# EasyEDA Pro project v7_h no callsign.eprj

# Schematic Schematic1
Board Name: Board1; Create Date: 2025-07-11; Page Name: P1; Project Name: v7_h; Schematic Name: Schematic1; Update Date: 2025-07-15; Company: KC3LBR; Drawed: EasyEDA Pro; Page Size: A3; Part Number: JLCPCB-001; Reviewed: EasyEDA Pro; Version: 2023.09.11
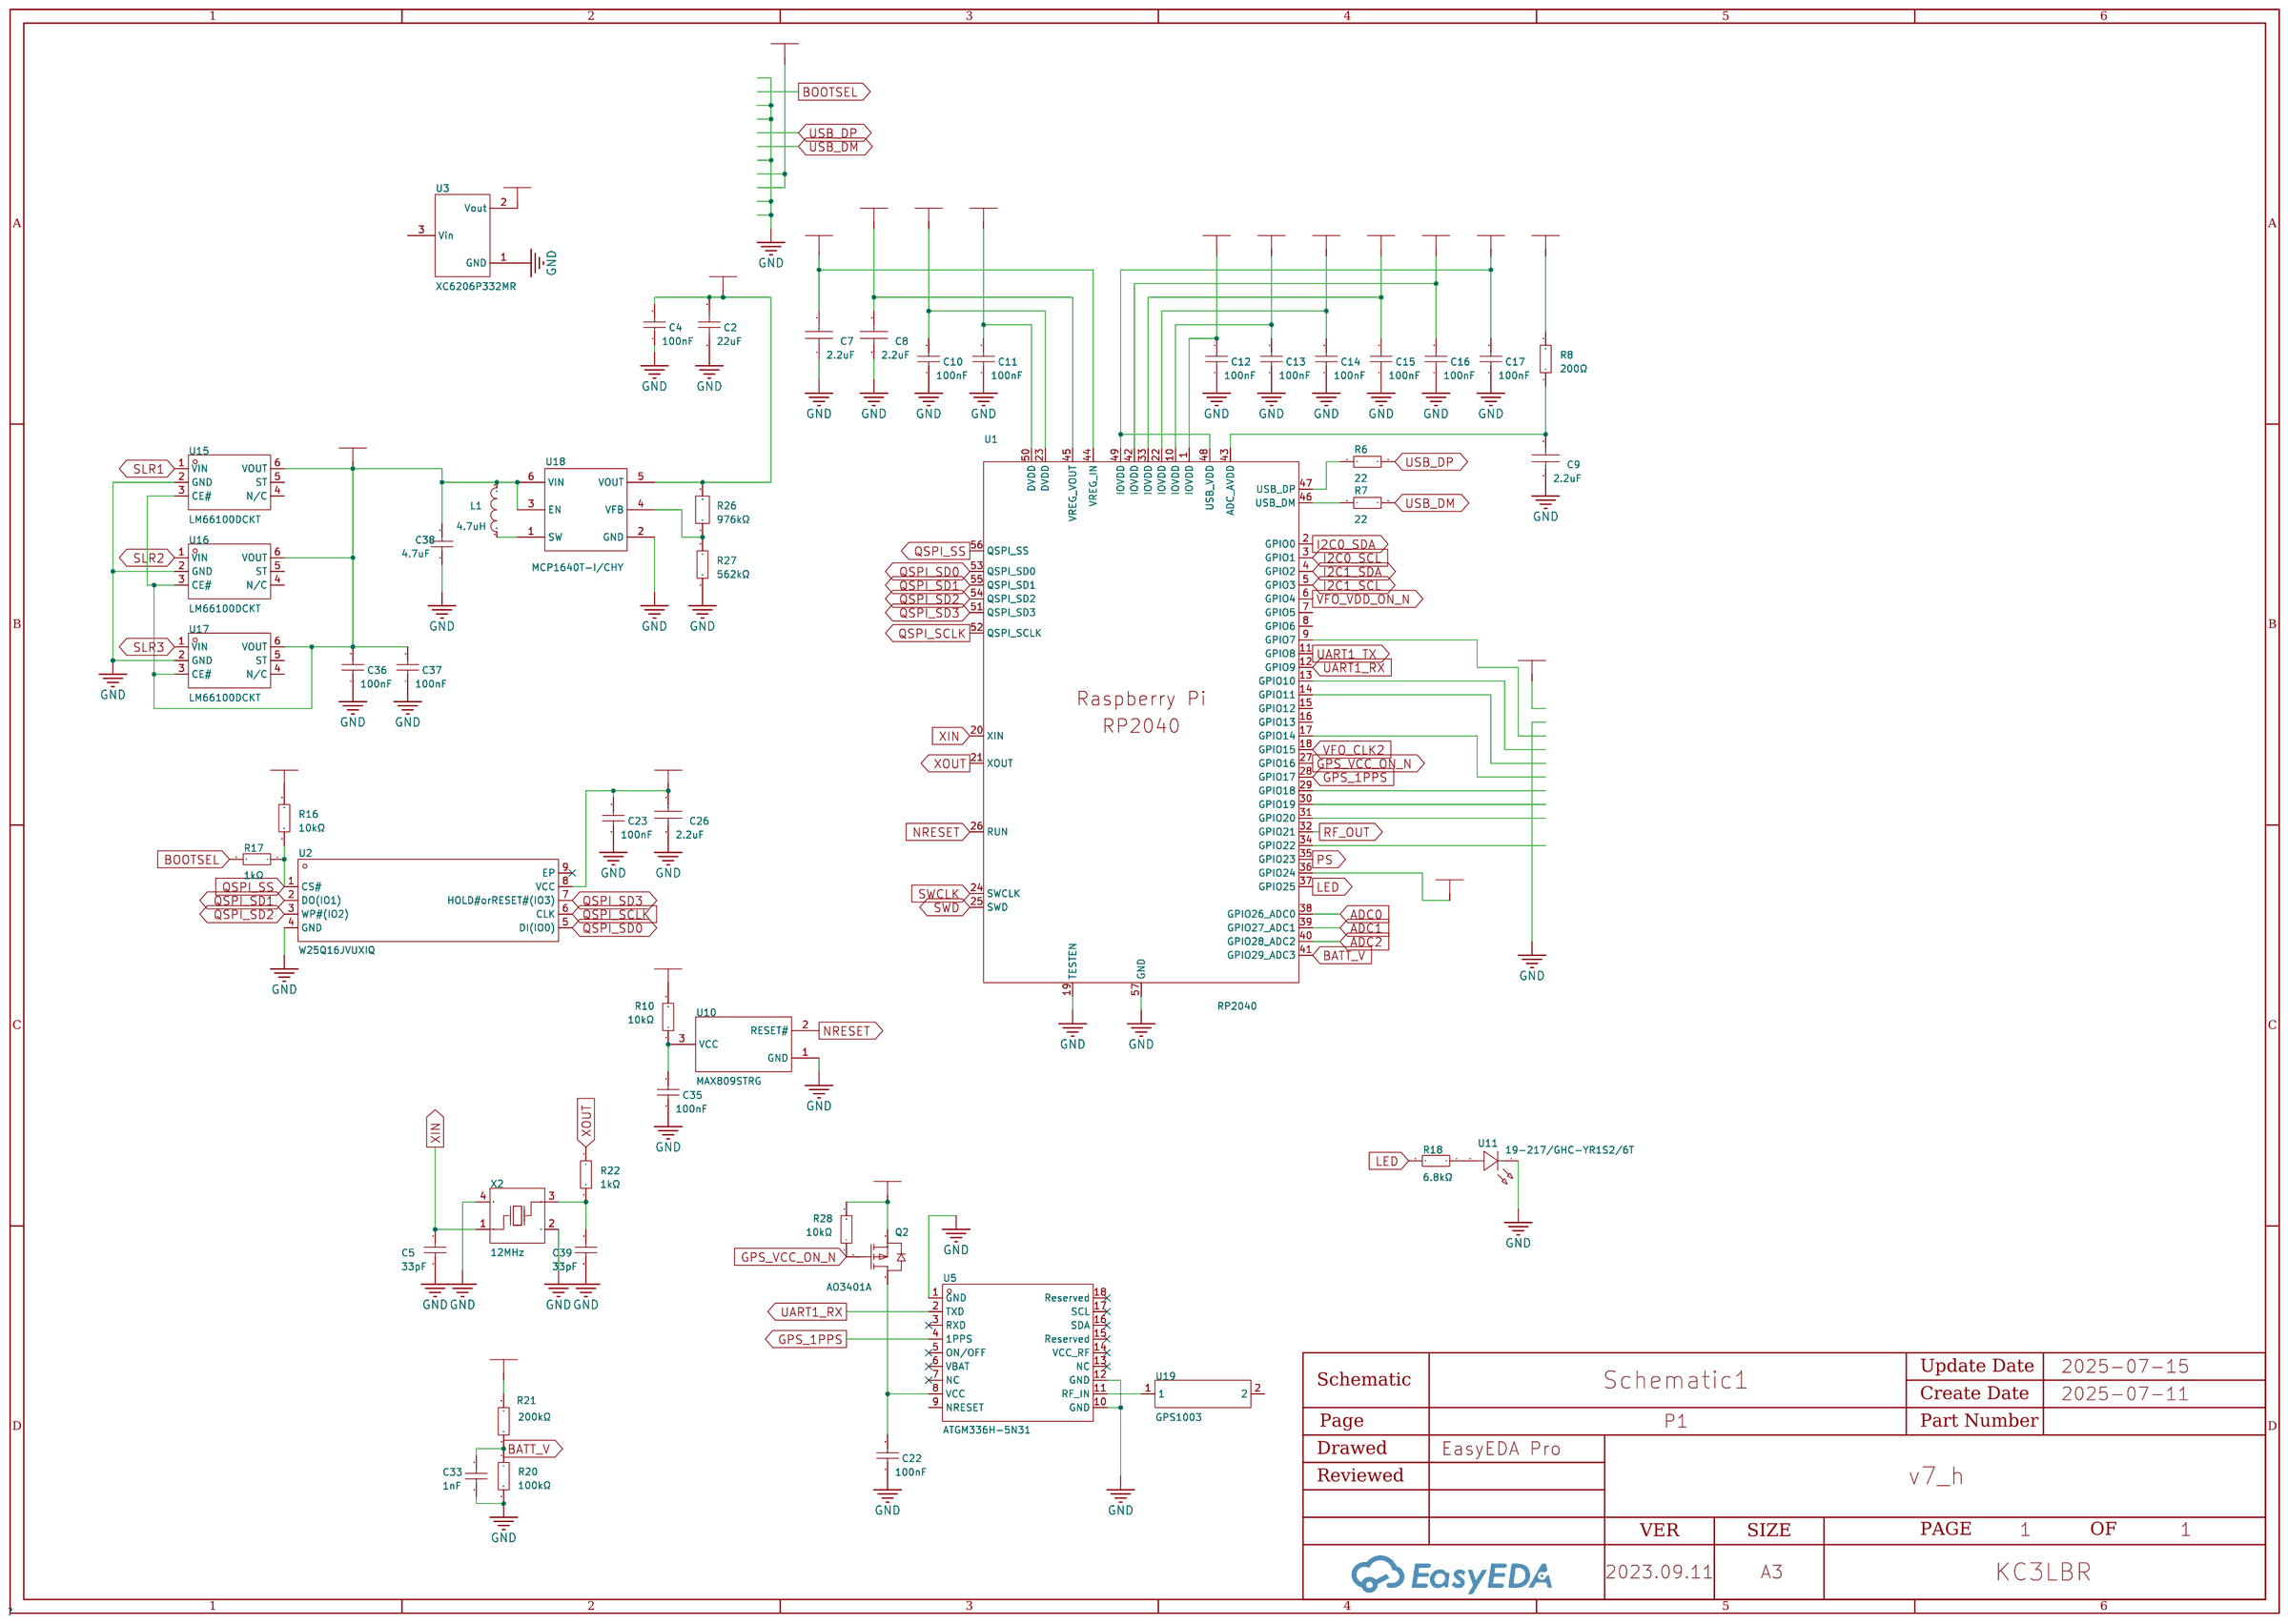
[diagram p0: schematic sheet]

## Parts
C2  22uF  [C0603]
C4  100nF  [C0402]
C5  33pF  [C0402]
C7  2.2uF  [C0402]
C8  2.2uF  [C0402]
C9  2.2uF  [C0402]
C10  100nF  [C0402]
C11  100nF  [C0402]
C12  100nF  [C0402]
C13  100nF  [C0402]
C14  100nF  [C0402]
C15  100nF  [C0402]
C16  100nF  [C0402]
C17  100nF  [C0402]
C22  100nF  [C0402]
C23  100nF  [C0402]
C26  2.2uF  [C0402]
C33  1nF  [C0402]
C35  100nF  [C0402_NEW]
C36  100nF  [C0402_NEW]
C37  100nF  [C0402_NEW]
C38  4.7uF  [C0603]
C39  33pF  [C0402]
L1  4.7uH  [IND-SMD_L2.5-W1.8]
Q2  AO3401A  [SOT-23_L2.9-W1.3-P1.90-LS2.4-BR]
R6  22  [R0402]
R7  22  [R0402]
R8  200Ω  [R0402]
R10  10kΩ  [R0402]
R16  10kΩ  [R0402]
R17  1kΩ  [R0402]
R18  6.8kΩ  [R0402]
R20  100kΩ  [R0402]
R21  200kΩ  [R0402]
R22  1kΩ  [R0402]
R26  976kΩ  [R0402]
R27  562kΩ  [R0402]
R28  10kΩ  [R0402]
U1  RP2040  [LQFN-56_L7.0-W7.0-P0.4-EP]
U2  W25Q16JVUXIQ  [USON-8_L3.0-W2.0-P0.50-BL-EP]
U3  XC6206P332MR  [SOT-23-3_L2.9-W1.3-P1.90-LS2.4-BR]
U5  ATGM336H-5N31  [GPSM-SMD_ATGM336H-TR]
U10  MAX809STRG  [SOT-23-3_L2.9-W1.6-P1.90-LS2.8-BR]
U11  19-217/GHC-YR1S2/6T  [LED0603-RD_GREEN]
U15  LM66100DCKT  [SC-70-6_L2.0-W1.3-P0.65-LS2.1-BL]
U16  LM66100DCKT  [SC-70-6_L2.0-W1.3-P0.65-LS2.1-BL]
U17  LM66100DCKT  [SC-70-6_L2.0-W1.3-P0.65-LS2.1-BL]
U18  MCP1640T-I/CHY  [SOT-23-6_L2.9-W1.6-P0.95-LS2.8-BR]
U19  GPS1003  [ANT-SMD_L10.0-W3.0]
X2  12MHz  [CRYSTAL-SMD_4P-L3.2-W2.5-BL]

## Library data of the parts
C2 = CL10A226MQ8NRNC: Capacitance: Tolerance:±20% Tolerance:±20% Voltage Rated: Temperature Coefficient:; LCSC Part Name: 22uF ±20% 6.3V; Supplier Part: C59461; Manufacturer: SAMSUNG(三星); Supplier Footprint: 0603; JLCPCB Part Class: Basic Part; Datasheet: https://atta.szlcsc.com/upload/public/pdf/source/20160218/1457707763339.pdf; Supplier: LCSC; Tolerance: ±20%
C4 C10-C17 C22 C23 = CL05B104KO5NNNC: Capacitance: Tolerance:±10% Tolerance:±10% Voltage Rated: Temperature Coefficient:; LCSC Part Name: 100nF ±10% 16V; Supplier Part: C1525; Manufacturer: SAMSUNG(三星); Supplier Footprint: 0402; JLCPCB Part Class: Basic Part; Datasheet: https://atta.szlcsc.com/upload/public/pdf/source/20160218/1457707763339.pdf; Supplier: LCSC; Tolerance: ±10%
C5 C39 = 0402CG330J500NT: Capacitance: Tolerance:±5% Tolerance:±5% Voltage Rated: Temperature Coefficient:; LCSC Part Name: 33pF ±5% 50V; Supplier Part: C1562; Manufacturer: FH(风华); Supplier Footprint: 0402; JLCPCB Part Class: Basic Part; Datasheet: https://atta.szlcsc.com/upload/public/pdf/source/20200305/C486355_26A10D38EF8C2A5C37091D0039909270.pdf; Supplier: LCSC; Tolerance: ±5%
C7-C9 C26 = CL05A225MQ5NSNC: Capacitance: Tolerance:±20% Tolerance:±20% Voltage Rated: Temperature Coefficient:; LCSC Part Name: 2.2uF ±20% 6.3V; Supplier Part: C12530; Manufacturer: SAMSUNG(三星); Supplier Footprint: 0402; JLCPCB Part Class: Basic Part; Datasheet: https://atta.szlcsc.com/upload/public/pdf/source/20160218/1457707763339.pdf; Supplier: LCSC; Tolerance: ±20%
C33 = 0402B102K500NT: Capacitance: Tolerance:±10% Tolerance:±10% Voltage Rated: Temperature Coefficient:; LCSC Part Name: 1nF ±10% 50V; Supplier Part: C1523; Manufacturer: FH(风华); Supplier Footprint: 0402; JLCPCB Part Class: Basic Part; Datasheet: https://atta.szlcsc.com/upload/public/pdf/source/20170923/C1523_1506149254821988331.pdf; Supplier: LCSC; Tolerance: ±10%
C35-C37 = CL05B104KO5NNNC: Capacitance: Tolerance:±10% Tolerance:±10% Voltage Rated: Temperature Coefficient:; LCSC Part Name: 100nF ±10% 16V; Supplier Part: C1525; Manufacturer: SAMSUNG(三星); Supplier Footprint: 0402; JLCPCB Part Class: Basic Part; Datasheet: https://atta.szlcsc.com/upload/public/pdf/source/20160103/1457707674891.pdf; Supplier: LCSC; Tolerance: ±10%
C38 = CL10A475KO8NNNC: Capacitance: Tolerance:±10% Tolerance:±10% Voltage Rated: Temperature Coefficient:; LCSC Part Name: 4.7uF ±10% 16V; Supplier Part: C19666; Manufacturer: SAMSUNG(三星); Supplier Footprint: 0603; JLCPCB Part Class: Basic Part; Datasheet: https://atta.szlcsc.com/upload/public/pdf/source/20160103/1457707703134.pdf; Supplier: LCSC; Tolerance: ±10%
L1 = CBC2518T4R7M: Type:- Inductance: Tolerance:±20% Tolerance:±20% Rated Current: Saturation Current (Isat):680mA DC Resistance (DCR): Ratings:-; LCSC Part Name: 4.7uH ±20% 680mA; Supplier Part: C268002; Manufacturer: TAIYO YUDEN(太诱); Supplier Footprint: SMD; JLCPCB Part Class: Extended Part; Datasheet: https://atta.szlcsc.com/upload/public/pdf/source/20180820/C268002_0E22732304EF0852B3951C6629BBBAB5.pdf; Supplier: LCSC; Tolerance: ±20%; Saturation Current (Isat): 680mA
Q2 = AO3401A_C15127: Type: Drain Source Voltage (Vdss): Continuous Drain Current (Id): Power Dissipation (Pd): Drain Source On Resistance (RDS(on)@Vgs,Id):44mΩ@10V,4.3A Gate Threshold Voltage (Vgs(th)@Id):1.3V@250uA; LCSC Part Name: P沟道 30V 4A; Supplier Part: C15127; Manufacturer: AOS; Supplier Footprint: SOT-23; JLCPCB Part Class: Basic Part; Datasheet: https://atta.szlcsc.com/upload/public/pdf/source/20160507/1462613609053.pdf; Supplier: LCSC; Drain Source On Resistance (RDS(on)@Vgs,Id): 44mΩ@10V,4.3A; Gate Threshold Voltage (Vgs(th)@Id): 1.3V@250uA
R6 R7 = 0402WGF220JTCE: LCSC Part Name: 22Ω(22R0) ±1% 编带; Supplier Part: C25092; Manufacturer: UNI-ROYAL(厚声); Supplier Footprint: 0402; JLCPCB Part Class: Basic Part; Datasheet: https://atta.szlcsc.com/upload/public/pdf/source/20170920/C25092_1505901206069982723.pdf; Supplier: LCSC
R8 = 0402WGF2000TCE: Type:Thick Film Resistors Resistance: Tolerance:±1% Tolerance:±1% Power(Watts): Temperature Coefficient:±100ppm/ Temperature Coefficient:±100ppm/ Overload Voltage (Max): Operating Temperature Range:-55~+155 Operating Temperature Range:-55~+155; LCSC Part Name: 200Ω ±1% 62.5mW; Supplier Part: C25087; Manufacturer: UNI-ROYAL(厚声); Supplier Footprint: 0402; JLCPCB Part Class: Basic Part; Datasheet: https://atta.szlcsc.com/upload/public/pdf/source/20200306/C422600_1E6D84923E4A46A82E41ADD87F860B5C.pdf; Supplier: LCSC; Type: Thick Film Resistors; Tolerance: ±1%; Temperature Coefficient: ±100ppm/; Operating Temperature Range: -55~+155
R10 R16 R28 = 0402WGF1002TCE: Type:Thick Film Resistors Resistance: Tolerance:±1% Tolerance:±1% Power(Watts): Temperature Coefficient:±100ppm/ Temperature Coefficient:±100ppm/ Overload Voltage (Max): Operating Temperature Range:-55~+155 Operating Temperature Range:-55~+155; LCSC Part Name: 10kΩ ±1% 62.5mW; Supplier Part: C25744; Manufacturer: UNI-ROYAL(厚声); Supplier Footprint: 0402; JLCPCB Part Class: Basic Part; Datasheet: https://atta.szlcsc.com/upload/public/pdf/source/20200306/C422600_1E6D84923E4A46A82E41ADD87F860B5C.pdf; Supplier: LCSC; Type: Thick Film Resistors; Tolerance: ±1%; Temperature Coefficient: ±100ppm/; Operating Temperature Range: -55~+155
R17 R22 = 0402WGF1001TCE: Type:Thick Film Resistors Resistance: Tolerance:±1% Tolerance:±1% Power(Watts): Temperature Coefficient:±100ppm/ Temperature Coefficient:±100ppm/ Overload Voltage (Max): Operating Temperature Range:-55~+155 Operating Temperature Range:-55~+155; LCSC Part Name: 1kΩ ±1% 62.5mW; Supplier Part: C11702; Manufacturer: UNI-ROYAL(厚声); Supplier Footprint: 0402; JLCPCB Part Class: Basic Part; Datasheet: https://atta.szlcsc.com/upload/public/pdf/source/20200306/C422600_1E6D84923E4A46A82E41ADD87F860B5C.pdf; Supplier: LCSC; Type: Thick Film Resistors; Tolerance: ±1%; Temperature Coefficient: ±100ppm/; Operating Temperature Range: -55~+155
R18 = 0402WGF6801TCE: Type:Thick Film Resistors Resistance: Tolerance:±1% Tolerance:±1% Power(Watts): Temperature Coefficient:±100ppm/ Temperature Coefficient:±100ppm/ Overload Voltage (Max): Operating Temperature Range:-55~+155 Operating Temperature Range:-55~+155; LCSC Part Name: 6.8kΩ ±1% 62.5mW; Supplier Part: C25917; Manufacturer: UNI-ROYAL(厚声); Supplier Footprint: 0402; JLCPCB Part Class: Basic Part; Datasheet: https://atta.szlcsc.com/upload/public/pdf/source/20200306/C422600_1E6D84923E4A46A82E41ADD87F860B5C.pdf; Supplier: LCSC; Type: Thick Film Resistors; Tolerance: ±1%; Temperature Coefficient: ±100ppm/; Operating Temperature Range: -55~+155
R20 = 0402WGF1003TCE: Type:Thick Film Resistors Resistance: Tolerance:±1% Tolerance:±1% Power(Watts): Temperature Coefficient:±100ppm/ Temperature Coefficient:±100ppm/ Overload Voltage (Max): Operating Temperature Range:-55~+155 Operating Temperature Range:-55~+155; LCSC Part Name: 100kΩ ±1% 62.5mW; Supplier Part: C25741; Manufacturer: UNI-ROYAL(厚声); Supplier Footprint: 0402; JLCPCB Part Class: Basic Part; Datasheet: https://atta.szlcsc.com/upload/public/pdf/source/20200306/C422600_1E6D84923E4A46A82E41ADD87F860B5C.pdf; Supplier: LCSC; Type: Thick Film Resistors; Tolerance: ±1%; Temperature Coefficient: ±100ppm/; Operating Temperature Range: -55~+155
R21 = 0402WGF2003TCE: Resistance: Tolerance: Power(Watts): Temperature Coefficient: Temperature Coefficient: Overload Voltage (Max): Operating Temperature Range: Operating Temperature Range:; LCSC Part Name: 200KΩ ±1%; Supplier Part: C25764; Manufacturer: UNI-ROYAL(厚声); Supplier Footprint: 0402; JLCPCB Part Class: Basic Part; Datasheet: https://atta.szlcsc.com/upload/public/pdf/source/20170920/C25764_1505901532268983339.pdf; Supplier: LCSC
R26 = RC0402FR-07976KL: Type:Thick Film Resistors Resistance: Tolerance:±1% Tolerance:±1% Power(Watts): Overload Voltage (Max): Temperature Coefficient:±100ppm/℃ Temperature Coefficient:±100ppm/℃ Operating Temperature Range:-55℃~+155℃ Operating Temperature Range:-55℃~+155℃; LCSC Part Name: 厚膜电阻 976kΩ ±1% 62.5mW; Supplier Part: C273699; Manufacturer: YAGEO(国巨); Supplier Footprint: 0402; JLCPCB Part Class: Extended Part; Datasheet: https://atta.szlcsc.com/upload/public/pdf/source/20191125/C364360_EA870FADD46A2AD4DBE56DD50D360B3E.pdf; Supplier: LCSC; Type: Thick Film Resistors; Tolerance: ±1%; Temperature Coefficient: ±100ppm/℃; Operating Temperature Range: -55℃~+155℃
R27 = RC0402FR-07562KL: Type:Thick Film Resistors Resistance: Tolerance:±1% Tolerance:±1% Power(Watts): Overload Voltage (Max): Temperature Coefficient:±100ppm/℃ Temperature Coefficient:±100ppm/℃ Operating Temperature Range:-55℃~+155℃ Operating Temperature Range:-55℃~+155℃; LCSC Part Name: 厚膜电阻 562kΩ ±1% 62.5mW; Supplier Part: C273337; Manufacturer: YAGEO(国巨); Supplier Footprint: 0402; JLCPCB Part Class: Extended Part; Datasheet: https://atta.szlcsc.com/upload/public/pdf/source/20180821/C275644_0D56F95EFF785E7D9A1FEF436B37DA78.pdf; Supplier: LCSC; Type: Thick Film Resistors; Tolerance: ±1%; Temperature Coefficient: ±100ppm/℃; Operating Temperature Range: -55℃~+155℃
U1 = RP2040_C2040: CPU Core:- RAM Size:264KB GPIO Ports Number:30 Operating Voltage Range:- Operating Voltage Range:- CPU Maximum Speed:133MHz Program Memory Type:- Operating Temperature Range:- Operating Temperature Range:- ADC (Bit):12bit DAC (Bit):- PWM (Bit):- 8Bit Time; LCSC Part Name: RP2040（RP2B2）; Supplier Part: C2040; Manufacturer: Raspberry Pi(树莓派); Supplier Footprint: LQFN-56(7x7); JLCPCB Part Class: Extended Part; Datasheet: https://atta.szlcsc.com/upload/public/pdf/source/20210621/C2040_96F425825606B7957D87DD32E2512CA9.pdf; Supplier: LCSC; Maximum Frequency: 133MHz; RAM Size: 264KB; GPIO Ports Number: 30; ADC (Units/Channels/bits): 1@x4ch/12bit; U(S)ART Number: 2; I2C Number: 2; (Q)SPI Number: 2; USB (H/D/OTG): USB Host/Device; Peripherals / Functions / Protocol Stacks: DMA；PWM; CPU Maximum Speed: 133MHz; ADC (Bit): 12bit; UART/USART: 2; I2C: 2; SPI: 2; Universal Serial Bus: 有; Peripheral/Function: DMA；PWM; Direct Memory Access: 有
U2 = W25Q16JVUXIQ: Supplier Part: C2843335; Manufacturer: WINBOND(华邦); Supplier Footprint: USON-8-EP(2x3); JLCPCB Part Class: Extended Part; Datasheet: https://atta.szlcsc.com/upload/public/pdf/source/20210629/C2843335_FB4D78B5076715625DC0C83F790D3044.pdf; Supplier: LCSC
U3 = XC6206P332MR_C6430947: Supplier Part: C6430947; Manufacturer: GOODWORK(固得沃克); Supplier Footprint: SOT-23; JLCPCB Part Class: Extended Part; Datasheet: https://atta.szlcsc.com/upload/public/pdf/source/20240218/986B5B990190AC417C3A75943F9A285D.pdf; Supplier: LCSC
U5 = ATGM336H-5N31: LCSC Part Name: BDS/GNSS 全星座定位导航模块; Supplier Part: C90770; Manufacturer: 杭州中科微; Supplier Footprint: SMD,9.7x10.1mm; JLCPCB Part Class: Extended Part; Datasheet: https://atta.szlcsc.com/upload/public/pdf/source/20161226/1482720799860.pdf; Supplier: LCSC
U10 = MAX809STRG: Output Type:推挽 Reset Active Level:低电平有效 Number of Voltages Monitored:1 Threshold Voltage:2.93V Reset Timeout:140ms Operating Temperature:-40~+105@(TJ) Operating Temperature:-40~+105@(TJ) Type of the Power Management Chip:Simple reset/Power-on reset; LCSC Part Name: Voltage Supervisor, Very Low Supply Current, 3-Pin Microprocessor, Reset Monitor; Supplier Part: C9965; Manufacturer: onsemi(安森美); Supplier Footprint: SOT-23; JLCPCB Part Class: Extended Part; Datasheet: https://atta.szlcsc.com/upload/public/pdf/source/20170918/C9965_1505727085373976535.PDF; Supplier: LCSC; Output Type: 推挽; Reset Active Level: 低电平有效; Number of Voltages Monitored: 1; Threshold Voltage: 2.93V; Reset Timeout: 140ms; Operating Temperature: -40~+105@(TJ); Type of the Power Management Chip: Simple reset/Power-on reset
U11 = 19-217/GHC-YR1S2/6T: LCSC Part Name: 翠绿; Supplier Part: C2986059; Manufacturer: EVERLIGHT(亿光); Supplier Footprint: 0603; JLCPCB Part Class: Extended Part; Datasheet: https://atta.szlcsc.com/upload/public/pdf/source/20220705/5270194960AA522E2931401D212035CB.pdf; Supplier: LCSC
U15-U17 = LM66100DCKT_C2832141: Output Current:1.5A Input Voltage:1.5V~5.5V Input Voltage:1.5V~5.5V Operating Temperature -:-40℃~+105℃ Operating Temperature -:-40℃~+105℃; Supplier Part: C2832141; Manufacturer: TI(德州仪器); Supplier Footprint: SC-70-6; JLCPCB Part Class: Extended Part; Datasheet: https://www.ti.com/cn/lit/gpn/lm66100; Supplier: LCSC; Output Current: 1.5A; Input Voltage: 1.5V~5.5V; Operating Temperature	-: -40℃~+105℃
U18 = MCP1640T-I/CHY: Function:Boost type Synchronous Rectification:Yes Number of Outputs:1 Topology:Boost Input Voltage:0.8V~5.5V Input Voltage:0.8V~5.5V Output Voltage:2V~5.5V Output Voltage:2V~5.5V Output Current (Max):350mA Switching Frequency:500kHz; LCSC Part Name: 升压型 Vin=0.8V~5.5V Vout=2V~5.5V 350mA; Supplier Part: C44365; Manufacturer: MICROCHIP(美国微芯); Supplier Footprint: SOT-23-6; JLCPCB Part Class: Extended Part; Datasheet: https://atta.szlcsc.com/upload/public/pdf/source/20150319/1457707270677.pdf; Supplier: LCSC; Function: Boost type; Synchronous Rectification: Yes; Number of Outputs: 1; Topology: Boost; Input Voltage: 0.8V~5.5V; Output Voltage: 2V~5.5V; Output Current (Max): 350mA; Switching Frequency: 500kHz
U19 = GPS1003: Supplier Part: C239243; Manufacturer: Rainsun(霖昱微); Supplier Footprint: SMD; JLCPCB Part Class: Extended Part; Datasheet: https://atta.szlcsc.com/upload/public/pdf/source/20180730/C239243_D9C604229B673F18F0675B95D946C54C.pdf; Supplier: LCSC
X2 = X322512MSB4SI: Crystal Type:Surface Mount Crystal Frequency: Normal temperature Frequency Tolerance:±10ppm Normal temperature Frequency Tolerance:±10ppm External load capacitor: Frequency Stability(Full temperature range):±20ppm Frequency Stability(Full temperature rang; LCSC Part Name: 12MHz ±10ppm 20pF; Supplier Part: C9002; Manufacturer: YXC(扬兴晶振); Supplier Footprint: SMD3225-4P; JLCPCB Part Class: Basic Part; Datasheet: https://atta.szlcsc.com/upload/public/pdf/source/20240329/19D5F850207469550BEB00D7DFEDBC7A.pdf; Supplier: LCSC; Crystal Type: Surface Mount Crystal; Normal temperature Frequency Tolerance: ±10ppm; Frequency Stability(Full temperature range): ±20ppm

## Nets
1V1: C8.2 C10.2 C11.2 U1.23(DVDD) U1.45(VREG_VOUT) U1.50(DVDD)
3V3: C2.2 C4.2 C7.2 C12.2 C13.2 C14.2 C15.2 C16.2 C17.2 C23.2 C26.2 Q2.2(S) R8.2 R10.2 R16.2 R26.2 R28.2 U1.1(IOVDD) U1.10(IOVDD) U1.22(IOVDD) U1.33(IOVDD) U1.36(GPIO24) U1.42(IOVDD) U1.44(VREG_IN) U1.48(USB_VDD) U1.49(IOVDD) U2.8(VCC) U3.2(Vout) U18.5(VOUT)
GND: C2.1 C4.1 C5.1 C7.1 C8.1 C9.1 C10.1 C11.1 C12.1 C13.1 C14.1 C15.1 C16.1 C17.1 C22.1 C23.1 C26.1 C33.1 C35.1 C36.1 C37.1 C38.1 C39.1 R20.2 R27.1 U1.19(TESTEN) U1.57(GND) U2.4(GND) U3.1(GND) U5.1(GND) U5.10(GND) U5.12(GND) U10.1(GND) U11.1(K) U15.2(GND) U16.2(GND) U17.2(GND) U18.2(GND) X2.2(GND) X2.4(GND)
VBUS: C36.2 C37.2 C38.2 L1.2 R21.2 U15.3(CE#) U15.6(VOUT) U16.3(CE#) U16.6(VOUT) U17.3(CE#) U17.6(VOUT) U18.3(EN) U18.6(VIN)
ADC0: U1.38(GPIO26_ADC0)
ADC1: U1.39(GPIO27_ADC1)
ADC2: U1.40(GPIO28_ADC2)
ADC_AVDD: C9.2 R8.1 U1.43(ADC_AVDD)
BATT_V: C33.2 R20.1 R21.1 U1.41(GPIO29_ADC3)
BOOTSEL: R17.2
GPIO7: U1.9(GPIO7)
GPIO10: U1.13(GPIO10)
GPIO11: U1.14(GPIO11)
GPIO14: U1.17(GPIO14)
GPIO18: U1.29(GPIO18)
GPIO19: U1.30(GPIO19)
GPIO20: U1.31(GPIO20)
GPIO22: U1.34(GPIO22)
GPS_1PPS: U1.28(GPIO17) U5.4(1PPS)
GPS_3V3: C22.2 Q2.3(D) U5.8(VCC)
GPS_VCC_ON_N: Q2.1(G) R28.1 U1.27(GPIO16)
I2C0_SCL: U1.3(GPIO1)
I2C0_SDA: U1.2(GPIO0)
I2C1_SCL: U1.5(GPIO3)
I2C1_SDA: U1.4(GPIO2)
LED: R18.2 U1.37(GPIO25)
NRESET: U1.26(RUN) U10.2(RESET#)
PS: U1.35(GPIO23)
QSPI_SCLK: U1.52(QSPI_SCLK) U2.6(CLK)
QSPI_SD0: U1.53(QSPI_SD0) U2.5(DI(IO0))
QSPI_SD1: U1.55(QSPI_SD1) U2.2(DO(IO1))
QSPI_SD2: U1.54(QSPI_SD2) U2.3(WP#(IO2))
QSPI_SD3: U1.51(QSPI_SD3) U2.7(HOLD#orRESET#(IO3))
QSPI_SS: R16.1 R17.1 U1.56(QSPI_SS) U2.1(CS#)
RF_OUT: U1.32(GPIO21)
SLR1: U15.1(VIN)
SLR2: U16.1(VIN)
SLR3: U17.1(VIN)
SWCLK: U1.24(SWCLK)
SWD: U1.25(SWD)
UART1_RX: U1.12(GPIO9) U5.2(TXD)
UART1_TX: U1.11(GPIO8)
USB_DM: R7.2
USB_DP: R6.2
VFO_CLK2: U1.18(GPIO15)
VFO_VDD_ON_N: U1.6(GPIO4)
XIN: C5.2 U1.20(XIN) X2.1(OSC1)
XOUT: R22.1 U1.21(XOUT)
$1N22007: R7.1 U1.46(USB_DM)
$1N22362: R6.1 U1.47(USB_DP)
$1N70752: C39.2 R22.2 X2.3(OSC2)
$1N115739: C35.2 R10.1 U10.3(VCC)
$1N146095: R18.1 U11.2(A)
$1N150578: U5.11(RF_IN) U19.1
$1N152319: L1.1 U18.1(SW)
$1N152323: R26.1 R27.2 U18.4(VFB)

Not connected (* = marked no-connect by the designer): U1 7(GPIO5) 8(GPIO6) 15(GPIO12) 16(GPIO13); U2 9(EP)*; U3 3(Vin); U5 3(RXD)* 5(ON/OFF)* 6(VBAT)* 7(NC)* 9(NRESET) 13(NC)* 14(VCC_RF)* 15(Reserved)* 16(SDA)* 17(SCL)* 18(Reserved)*; U15 4(N/C) 5(ST); U16 4(N/C) 5(ST); U17 4(N/C) 5(ST); U19 2

# Board PCB1
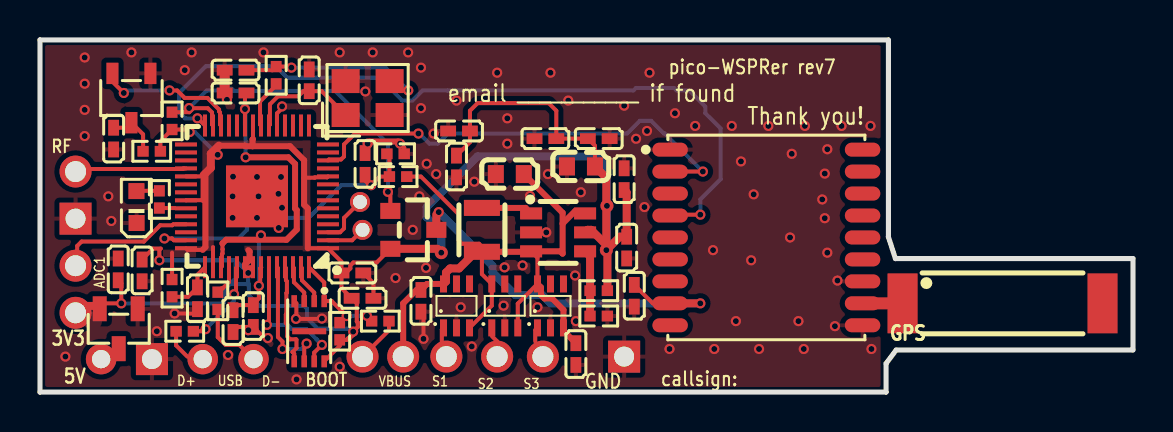
[diagram p1: board, top side]
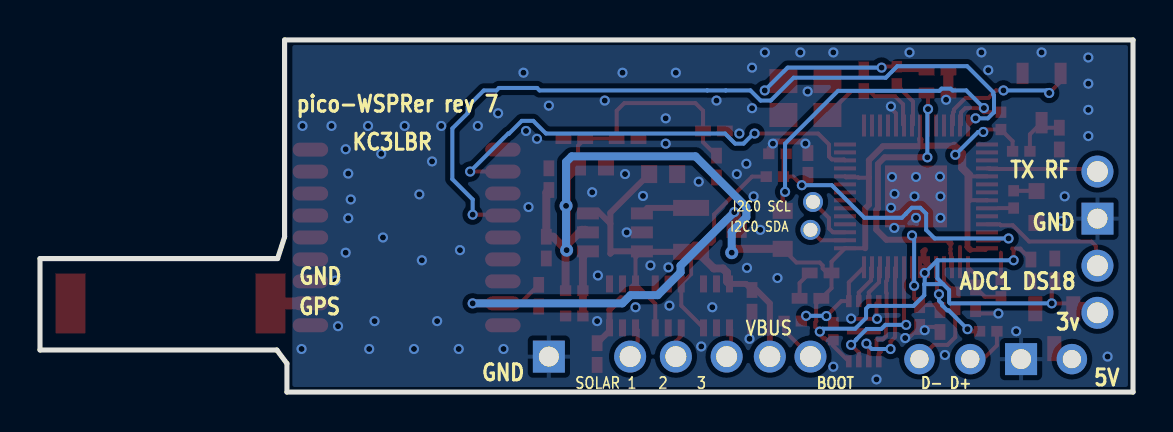
[diagram p2: board, bottom side, seen from below]

Outline 54.66 x 17.64 mm; copper layers: Top Layer, Bottom Layer. Coordinates in mm from the lower left corner of the outline.
Outline path: 0,17.64 42.42,17.64 42.42,7.78 42.77,6.69 54.66,6.69 54.66,2.11 42.81,2.11 42.31,1.43 42.31,0 0,0 0,17.64
Stack: Top Layer 0.035mm / Dielectric1 1.51mm FR4 er 4.5 / Bottom Layer 0.035mm

## Design rules (mm)
template: User Custom Config
spacing safeClearance (default): track to track 0.152, other pairs 0.12 to 0.3
track width trackWidth (default): min 0.127, default 0.154, max 2.54
track width ThickTrack: min 0.3, default 0.4, max 2.54
differential pair differentialPair (default): width min 0.127, default 0.254, max 2.54; gap min 0.152, default 0.152
via viaSize (default): diameter min 0.5, default 0.508, max 10; hole min 0.3, default 0.3, max 5.999

## Placement (name value [footprint] x y rotation side)
C2  22uF  [C0603]  27.05 11.3 0 top
C4  100nF  [C0402]  16.13 4.7 180 top
C5  33pF  [C0402]  13.46 15.62 270 top
C7  2.2uF  [C0402]  5.11 6.1 90 top
C8  2.2uF  [C0402]  10.67 3.81 90 top
C9  2.2uF  [C0402]  7.87 4.7 90 top
C10  100nF  [C0402]  9.78 14.99 0 top
C11  100nF  [C0402]  9.65 3.56 90 top
C12  100nF  [C0402]  25.27 12.7 0 top
C13  100nF  [C0402]  29.21 10.67 270 top
C14  100nF  [C0402]  29.34 7.24 90 top
C15  100nF  [C0402]  3.91 6.15 270 top
C16  100nF  [C0402]  15.62 5.97 180 top
C17  100nF  [C0402]  20.83 11.3 90 top
C22  100nF  [C0402]  29.72 4.83 90 top
C23  100nF  [C0402]  20.96 13.08 0 top
C26  2.2uF  [C0402]  27.94 12.7 180 top
C33  1nF  [C0402]  16.26 11.43 270 top
C35  100nF  [C0402_NEW]  3.68 12.7 90 top
C36  100nF  [C0402_NEW]  19.05 4.57 90 top
C37  100nF  [C0402_NEW]  26.8 1.91 90 top
C38  4.7uF  [C0603]  23.5 10.92 0 top
C39  33pF  [C0402]  9.78 16.13 0 top
L1  4.7uH  [IND-SMD_L2.5-W1.8]  22.1 8.13 270 top
NOREF  -  [Pad_e1477]  25.15 1.78 0 top
NOREF#2  -  [Pad_e4]  16 9.53 0 top
NOREF#3  -  [Pad_e1763]  10.68 1.65 0 top
NOREF#4  -  [Pad_e41]  1.78 6.33 0 top
NOREF#5  -  [Pad_e10]  3.06 1.65 0 top
NOREF#6  -  [Pad_e1305]  1.78 3.97 0 top
NOREF#7  -  [Pad_e4139]  16.13 1.78 0 top
NOREF#8  -  [Pad_e1784]  8.14 1.65 0 top
NOREF#9  -  [Pad_e861]  29.21 1.78 0 top
NOREF#10  -  [Pad_e93]  1.78 8.69 0 top
NOREF#11  -  [Pad_e5]  16.13 8.13 0 top
NOREF#12  -  [Pad_e1583]  18.16 1.78 0 top
NOREF#13  -  [Pad_e19]  5.6 1.65 0 top
NOREF#14  -  [Pad_e33]  1.78 11.05 0 top
NOREF#15  -  [Pad_e1471]  20.32 1.78 0 top
NOREF#16  -  [Pad_e1476]  22.86 1.78 0 top
Q2  AO3401A  [SOT-23_L2.9-W1.3-P1.90-LS2.4-BR]  18.67 8.13 180 top
R6  22  [R0402]  7.24 3.05 180 top
R7  22  [R0402]  8.89 4.57 270 top
R8  200Ω  [R0402]  6.6 5.21 90 top
R10  10kΩ  [R0402]  5.59 12.06 0 top
R16  10kΩ  [R0402]  14.99 3.05 270 top
R17  1kΩ  [R0402]  17.02 3.56 0 top
R18  6.8kΩ  [R0402]  5.97 9.65 270 top
R20  100kΩ  [R0402]  17.78 11.94 0 top
R21  200kΩ  [R0402]  17.91 10.8 0 top
R22  1kΩ  [R0402]  11.81 15.88 90 top
R26  976kΩ  [R0402]  27.94 5.08 0 top
R27  562kΩ  [R0402]  27.94 3.81 180 top
R28  10kΩ  [R0402]  6.6 13.59 270 top
U1  RP2040  [LQFN-56_L7.0-W7.0-P0.4-EP]  10.85 9.81 180 top
U2  W25Q16JVUXIQ  [USON-8_L3.0-W2.0-P0.50-BL-EP]  13.46 3.05 180 top
U3  XC6206P332MR  [SOT-23-3_L2.9-W1.3-P1.90-LS2.4-BR]  3.94 3.17 90 top
U5  ATGM336H-5N31  [GPSM-SMD_ATGM336H-TR]  36.32 7.75 90 top
U10  MAX809STRG  [SOT-23-3_L2.9-W1.6-P1.90-LS2.8-BR]  4.57 14.73 90 top
U11  19-217/GHC-YR1S2/6T  [LED0603-RD_GREEN]  4.83 9.27 90 top
U15  LM66100DCKT  [SC-70-6_L2.0-W1.3-P0.65-LS2.1-BL]  20.83 4.32 0 top
U16  LM66100DCKT  [SC-70-6_L2.0-W1.3-P0.65-LS2.1-BL]  23.24 4.32 0 top
U17  LM66100DCKT  [SC-70-6_L2.0-W1.3-P0.65-LS2.1-BL]  25.53 4.32 0 top
U18  MCP1640T-I/CHY  [SOT-23-6_L2.9-W1.6-P0.95-LS2.8-BR]  25.91 8 180 top
U19  GPS1003  [ANT-SMD_L10.0-W3.0]  48.13 4.45 0 top
X2  12MHz  [CRYSTAL-SMD_4P-L3.2-W2.5-BL]  16.38 14.73 0 top

## Footprints (pads in the part's own frame, mm; a bottom-side part is the same pattern mirrored in y, then rotated)
ANT-SMD_L10.0-W3.0
  rect 1.5x3 smd: 1(-5,0) 2(5,0)
C0402
  rect 0.79x0.54 smd: 1(-0.545,0) 2(0.545,0)
C0402_NEW
  rect 0.79x0.54 smd: 1(-0.545,0) 2(0.545,0)
C0603
  rect 0.8x0.9 smd: 1(-0.7,0) 2(0.7,0)
CRYSTAL-SMD_4P-L3.2-W2.5-BL
  rect 1.4x1.2 smd: 1(-1.1,-0.85) 2(1.1,-0.85) 3(1.1,0.85) 4(-1.1,0.85)
GPSM-SMD_ATGM336H-TR
  oval 0.7x1.773 smd: 1(4.4,4.811) 2(3.3,4.811) 3(2.2,4.811) 4(1.1,4.811) 5(0,4.811) 6(-1.1,4.811) 7(-2.2,4.811) 8(-3.3,4.811) 9(-4.4,4.811) 10(-4.4,-4.811) 11(-3.3,-4.811) 12(-2.2,-4.811) 13(-1.1,-4.811) 14(0,-4.811) 15(1.1,-4.811) 16(2.2,-4.811) 17(3.3,-4.811) 18(4.4,-4.811)
IND-SMD_L2.5-W1.8
  rect 0.8x1.8 smd: 1(-1.1,0) 2(1.1,0)
LED0603-RD_GREEN
  rect 0.8x0.8 smd: 1(-0.799,-0.004) 2(0.799,0.004)
LQFN-56_L7.0-W7.0-P0.4-EP
  rect 1.1x0.2 smd: 1(-3.55,2.6) 2(-3.55,2.2) 3(-3.55,1.8) 4(-3.55,1.4) 5(-3.55,1) 6(-3.55,0.6) 7(-3.55,0.2) 8(-3.55,-0.2) 9(-3.55,-0.6) 10(-3.55,-1) 11(-3.55,-1.4) 12(-3.55,-1.8) 13(-3.55,-2.2) 14(-3.55,-2.6) 29(3.55,-2.6) 30(3.55,-2.2) 31(3.55,-1.8) 32(3.55,-1.4) 33(3.55,-1) 34(3.55,-0.6) 35(3.55,-0.2) 36(3.55,0.2) 37(3.55,0.6) 38(3.55,1) 39(3.55,1.4) 40(3.55,1.8) 41(3.55,2.2) 42(3.55,2.6)
  rect 0.2x1.1 smd: 15(-2.6,-3.55) 16(-2.2,-3.55) 17(-1.8,-3.55) 18(-1.4,-3.55) 19(-1,-3.55) 20(-0.6,-3.55) 21(-0.2,-3.55) 22(0.2,-3.55) 23(0.6,-3.55) 24(1,-3.55) 25(1.4,-3.55) 26(1.8,-3.55) 27(2.2,-3.55) 28(2.6,-3.55) 43(2.6,3.55) 44(2.2,3.55) 45(1.8,3.55) 46(1.4,3.55) 47(1,3.55) 48(0.6,3.55) 49(0.2,3.55) 50(-0.2,3.55) 51(-0.6,3.55) 52(-1,3.55) 53(-1.4,3.55) 54(-1.8,3.55) 55(-2.2,3.55) 56(-2.6,3.55)
  rect 3.1x3.1 smd: 57(0,0)
Pad_e4
  round 1 hole 0.7: 17(0,0)
Pad_e5
  round 1 hole 0.7: 17(0,0)
Pad_e10
  round 1.524 hole 0.914: 17(0,0)
Pad_e19
  rect 1.6x1.6 hole 1: 7(0,0)
Pad_e33
  round 1.6 hole 1.05: 14(0,0)
Pad_e41
  round 1.6 hole 1.05: 17(0,0)
Pad_e93
  rect 1.6x1.6 hole 1: 7(0,0)
Pad_e861
  rect 1.6x1.6 hole 1: 7(0,0)
Pad_e1305
  round 1.6 hole 1.05: 15(0,0)
Pad_e1471
  round 1.6 hole 1.05: 18(0,0)
Pad_e1476
  round 1.6 hole 1.05: 18(0,0)
Pad_e1477
  round 1.6 hole 1.05: 18(0,0)
Pad_e1583
  round 1.6 hole 1.05: 18(0,0)
Pad_e1763
  round 1.524 hole 0.914: 17(0,0)
Pad_e1784
  round 1.524 hole 0.914: 17(0,0)
Pad_e4139
  round 1.6 hole 1.05: 18(0,0)
R0402
  rect 0.566x0.54 smd: 1(-0.433,0) 2(0.433,0)
SC-70-6_L2.0-W1.3-P0.65-LS2.1-BL
  rect 0.35x0.85 smd: 1(-0.65,-1.1) 2(0,-1.1) 3(0.65,-1.1) 4(0.65,1.1) 5(0,1.1) 6(-0.65,1.1)
SOT-23-3_L2.9-W1.3-P1.90-LS2.4-BR
  rect 1.25x0.7 smd: 1(1,-0.95) 2(1,0.95) 3(-1,0)
SOT-23-3_L2.9-W1.6-P1.90-LS2.8-BR
  rect 1.07x0.6 smd: 1(1.235,-0.95) 2(1.235,0.95) 3(-1.235,0)
SOT-23-6_L2.9-W1.6-P0.95-LS2.8-BR
  rect 1.1x0.6 smd: 1(1.35,-0.95) 2(1.35,0) 3(1.35,0.95) 4(-1.35,0.95) 5(-1.35,0) 6(-1.35,-0.95)
SOT-23_L2.9-W1.3-P1.90-LS2.4-BR
  rect 1x0.8 smd: 1(1.15,-0.95) 2(1.15,0.95) 3(-1.15,0)
USON-8_L3.0-W2.0-P0.50-BL-EP
  rect 0.28x0.6 smd: 1(-0.75,-1.508) 2(-0.25,-1.508) 3(0.25,-1.508) 4(0.75,-1.508) 5(0.75,1.508) 6(0.25,1.508) 7(-0.25,1.508) 8(-0.75,1.508)
  rect 1.7x0.3 smd: 9(0,0)

## Nets
1V1: C8.2 C10.2 C11.2 U1.23 U1.45 U1.50
3V3: C2.2 C4.2 C7.2 C12.2 C13.2 C14.2 C15.2 C16.2 C17.2 C23.2 C26.2 NOREF#6.15 Q2.2 R8.2 R10.2 R16.2 R26.2 R28.2 U1.1 U1.10 U1.22 U1.33 U1.36 U1.42 U1.44 U1.48 U1.49 U2.8 U3.2 U18.5
GND: C2.1 C4.1 C5.1 C7.1 C8.1 C9.1 C10.1 C11.1 C12.1 C13.1 C14.1 C15.1 C16.1 C17.1 C22.1 C23.1 C26.1 C33.1 C35.1 C36.1 C37.1 C38.1 C39.1 NOREF#9.7 NOREF#10.7 NOREF#13.7 R20.2 R27.1 U1.19 U1.57 U2.4 U3.1 U5.1 U5.10 U5.12 U10.1 U11.1 U15.2 U16.2 U17.2 U18.2 X2.2 X2.4
VBUS: C36.2 C37.2 C38.2 L1.2 NOREF#12.18 R21.2 U15.3 U15.6 U16.3 U16.6 U17.3 U17.6 U18.3 U18.6
ADC0: U1.38
ADC1: NOREF#4.17 U1.39
ADC2: U1.40
ADC_AVDD: C9.2 R8.1 U1.43
BATT_V: C33.2 R20.1 R21.1 U1.41
BOOTSEL: NOREF#7.18 R17.2
GPIO7: U1.9
GPIO10: U1.13
GPIO11: U1.14
GPIO14: U1.17
GPIO18: U1.29
GPIO19: U1.30
GPIO20: U1.31
GPIO22: U1.34
GPS_1PPS: U1.28 U5.4
GPS_3V3: C22.2 Q2.3 U5.8
GPS_VCC_ON_N: Q2.1 R28.1 U1.27
I2C0_SCL: NOREF#2.17 U1.3
I2C0_SDA: NOREF#11.17 U1.2
I2C1_SCL: U1.5
I2C1_SDA: U1.4
LED: R18.2 U1.37
NRESET: U1.26 U10.2
PS: U1.35
QSPI_SCLK: U1.52 U2.6
QSPI_SD0: U1.53 U2.5
QSPI_SD1: U1.55 U2.2
QSPI_SD2: U1.54 U2.3
QSPI_SD3: U1.51 U2.7
QSPI_SS: R16.1 R17.1 U1.56 U2.1
RF_OUT: NOREF#14.14 U1.32
SLR1: NOREF#15.18 U15.1
SLR2: NOREF#16.18 U16.1
SLR3: NOREF.18 U17.1
SWCLK: U1.24
SWD: U1.25
UART1_RX: U1.12 U5.2
UART1_TX: U1.11
USB_DM: NOREF#3.17 R7.2
USB_DP: NOREF#8.17 R6.2
VFO_CLK2: U1.18
VFO_VDD_ON_N: U1.6
XIN: C5.2 U1.20 X2.1
XOUT: R22.1 U1.21
$1N22007: R7.1 U1.46
$1N22362: R6.1 U1.47
$1N70752: C39.2 R22.2 X2.3
$1N115739: C35.2 R10.1 U10.3
$1N146095: R18.1 U11.2
$1N150578: U5.11 U19.1
$1N152319: L1.1 U18.1
$1N152323: R26.1 R27.2 U18.4

Pads without a net: NOREF#5 17; U1 7 8 15 16; U2 9; U3 3; U5 3 5 6 7 9 13 14 15 16 17 18; U15 4 5; U16 4 5; U17 4 5; U19 2

## Via types
v1: diameter 0.65, hole 0.3, Top Layer to Bottom Layer, 3 vias
v2: diameter 0.508, hole 0.3, Top Layer to Bottom Layer, 131 vias

## Routing (per net, layer and track width the routed paths; a pad name or vN(x,y) marks a point on that pad's centre or on a via; arc(x,y) is an arc through that point)
1V1: length 21
  Top Layer w0.2: 10.32,14.99 10.25,14.91 v2(10.25,14.18) 10.25,13.36 ; U1.45 9.1,6.3 9.1,6.91 9.13,6.94 9.13,7.15 9.13,7.16 9.13,7.45 ; C11.2 9.91,4.36 C8.2 10.67,4.41 10.94,4.69 v2(10.94,5.33) 11.01,5.39 11.01,6.2 11.06,6.25 U1.50
  Top Layer w0.3: 9.13,7.45 9.13,7.45 9.31,7.63 12.33,7.63 12.84,8.14 12.84,9.11 12.76,9.2 12.76,11.43 12.42,11.76 v2(10.28,11.76)
  Bottom Layer w0.2: v2(10.94,5.33) 10.94,7.75 v2(11.05,7.85) ; v2(10.25,14.18) 10.28,14.15 v2(10.28,11.76)
3V3: length 108.7
  Top Layer w0.2: R8.2 6.6,6.98 ; C16.2 15.08,5.21 C4.2 15.84,4.44 15.84,3.53 15.89,3.49 15.89,3.26 v2(15.66,3.03) 15.63,3 15.63,2.84 15.49,2.69 15.4,2.69 15.32,2.61 R16.2 14.99,2.31 U2.8 ; C16.2 15.08,6.53 U1.1 13.39,7.21 ; C16.2 15.29,5.97 15.52,6.19 15.52,6.34 15.67,6.49 16.83,6.49 Q2.2 ; 8.18,9.61 7.31,9.61 U1.36 ; U1.42 7.38,7.13 8.13,7.13 ; U1.44 8.65,7.27 ; C15.2 4.06,5.45 v2(4.06,4.45) 3.26,4.45 U3.2 ; C17.2 21.5,12.52 C23.2 21.5,14.1 21.88,14.48 25.44,14.48 25.82,14.1 C12.2 C26.2 27.75,12.34 C2.2 ; v2(5.97,6.6) 5.97,7.12 6.04,7.19 5.63,7.19 5.63,7.16 C7.2 ; 10.25,6.26 U1.49 ; U1.33 8.12,10.81 ; 10.65,12.68 U1.22 ; v2(7.49,13.03) 7.36,13.16 R28.2 6.02,12.57 R10.2 ; U1.10 14.35,10.76 13.75,10.76 13.73,10.74 13.21,10.74
  Top Layer w0.3: 8.13,7.13 8.28,7.27 8.28,10.87 ; 13.39,7.21 13.39,9.2 13.21,9.39 13.21,11.62 12.5,12.32 10.63,12.32 ; 10.41,7.11 10.48,7.05 10.48,6.62 10.25,6.39 10.25,6.26 ; 10.65,12.68 10.63,12.66 10.63,12.32 ; 8.18,9.61 8.18,10.87 ; 8.94,12.35 10.25,12.35 10.28,12.32 10.63,12.32
  Top Layer w0.4: C13.2 29.34,10 C14.2 28.99,7.78 v1(28.32,7.11) 28.37,7.06 R26.2 ; 8.18,10.87 8.54,11.23 8.54,11.95 8.94,12.35 ; Q2.2 19.87,7.18 v1(20.07,6.98) ; U18.5 27.38,8.13 27.56,8.13 28.32,7.37 28.32,10.73 C2.2 ; U3.2 2.84,4.32 1.78,4.32
  Bottom Layer w0.2: 10.44,5.41 10.44,5.41 ; 10.44,5.41 10.41,5.43 v2(10.41,5.97) 9.78,6.6 ; 10.44,5.41 9.49,5.41 ; v2(8.89,11.89) 7.74,13.03 v2(7.49,13.03) ; v2(4.06,4.45) 9.14,4.45 9.2,4.5 9.2,5.11 9.49,5.41 ; 10.44,5.41 10.44,4.85 10.97,4.32 13.21,4.32 13.35,4.18 13.35,3.72 13.89,3.17 15.52,3.17 v2(15.66,3.03) ; 9.78,6.6 v2(5.97,6.6) ; 9.78,6.6 9.78,5.69 9.49,5.41
  Bottom Layer w0.4: v1(28.32,7.11) 28.35,7.14 v1(28.35,9.33) 28.35,11.53 28.07,11.81 21.88,11.81 19.33,9.27 19.33,8.77 20.07,8.03 v1(20.07,6.98)
GND: length 13.4
  Top Layer w0.2: v2(16.38,12.45) 16.38,12.25 ; v2(12.1,14.31) 12.1,14.22 11.85,13.96 U1.19 ; U2.4 12.82,4.45 12.82,3.77 12.92,3.67 ; 12.92,3.67 14.08,3.67 v2(14.1,3.68) ; 12.92,3.67 v2(12.8,3.67) 12.83,3.64 12.95,3.64 12.92,3.67 ; v2(19.18,2.67) 19.18,3.9 C36.1 ; v2(18.01,12.45) 18.21,12.24 R20.2 ; C9.1 7.66,3.94 v2(6.73,3.94) ; v2(11.39,2.71) 11.22,2.71 C8.1 9.91,3.27 C11.1 ; C4.1 16.67,5.46 C16.1
  Top Layer w0.3: v2(18.01,12.45) 17.9,12.55 16.49,12.55 v2(16.38,12.45)
  Top Layer w0.5: C10.1 C39.1
  vias: v2(1.27,1.78) v2(2.23,16.76) v2(2.23,15.45) v2(2.23,14.14) v2(2.23,12.83) v2(3.42,9.81) v2(3.57,8.57) v2(4.57,17.02) v2(5.84,3.05) v2(7.24,16.13) v2(7.58,17.02) v2(9.35,14.65) v2(9.41,1.86) v2(9.65,10.8) v2(9.63,9.81) v2(9.63,8.73) v2(10.42,3.1) v2(10.85,10.78) v2(10.85,8.73) v2(10.93,9.81) v2(11.18,17.02) v2(11.92,9.93) v2(11.94,8.23) v2(12.05,10.78) v2(12.1,9.24) v2(12.83,0.64) v2(14.99,17.02) v2(14.99,1.27) v2(16.27,15.06) v2(16.64,17.02) v2(17.78,5.72) v2(18.41,17.02) v2(18.64,8.13) v2(18.97,9.81) v2(19.05,16.26) v2(19.05,14.22) v2(19.3,6.22) v2(19.33,11.44) v2(19.69,12.95) v2(19.81,10.92) v2(20.83,14.61) v2(21.04,4.25) v2(21.59,2.29) v2(21.72,10.54) v2(22.86,16) v2(23.18,4.33) v2(23.23,6.25) v2(23.37,13.72) v2(23.37,12.45) v2(24.13,6.34) v2(24.5,9.83) v2(24.88,4.25) v2(25.4,10.92) v2(25.32,8) v2(25.53,16) v2(26.42,14.61) v2(26.76,5.84) v2(26.8,3.56) v2(27.04,10.01) v2(29.21,14.35) v2(29.81,12.69) v2(30.23,9.27) v2(30.35,13.08) v2(30.48,16) v2(31.48,2.16) v2(31.75,13.97) v2(32.76,13.34) v2(33.66,7.11) v2(33.72,2.16) v2(34.59,13.34) v2(34.8,3.56) v2(35.05,11.56) v2(35.56,6.6) v2(35.69,9.91) v2(35.96,2.16) v2(36.42,13.34) v2(37.51,7.75) v2(37.59,11.94) v2(37.93,3.56) v2(38.19,2.16) v2(38.25,13.34) v2(39.12,9.65) v2(39.24,10.95) v2(39.24,8.71) v2(39.37,12.17) v2(39.37,6.98) v2(39.75,3.3) v2(39.88,5.59) v2(40.08,13.34) v2(41.53,13.34) v2(41.58,2.16)
VBUS: length 37.3
  Top Layer w0.2: U16.3 23.89,4.43 U17.6 24.88,6.73 24.56,7.05 ; U15.3 22.59,4.33 U16.6 22.1,5.91 L1.2 22.1,7.29 21.96,7.43 21.09,7.43 20.95,7.58 20.95,8.9 19.05,10.8 R21.2
  Top Layer w0.3: C38.2 26.13,8.98 26.13,8.44 ; 26.13,8.44 26.13,6.94 26.02,7.05 24.56,7.05 24.53,7.03 L1.2 ; 26.13,8.44 26.77,9.08 27.13,9.08 U18.6 ; U15.6 19.35,5.42 C36.2 18.83,5.12 18.16,4.45 NOREF#12.18 ; C37.2 26.18,3.07 U17.3 26.18,4.12 25.6,4.69 25.23,4.69 25.05,4.87 25.05,5.25 U17.6
  Top Layer w0.4: L1.2 21.79,7.03 20.96,6.2 20.51,6.2 20.3,5.99 20.3,5.54 U15.6
(no net): length 1.1
  Top Layer w0.2: U3.3 3.94,2.16 3.43,1.65 NOREF#5.17
ADC1: length 6.5
  Top Layer w0.2: U1.39 6.67,8.41 6.62,8.36 6.01,8.36 5.2,7.54 2.08,7.54 1.86,7.32 1.86,6.66
ADC_AVDD: length 2.6
  Top Layer w0.2: U1.43 7.87,5.88 C9.2 7.4,4.77 R8.1
BATT_V: length 16.4
  Top Layer w0.2: R20.1 17.47,11.81 17.47,10.8 16.99,10.8 v2(16.56,10.36) ; U1.41 6.69,7.61 6.6,7.7 v2(6.22,7.7)
  Top Layer w0.3: v2(16.56,10.36) 16.26,10.67 C33.2
  Bottom Layer w0.2: v2(16.56,10.36) 15.06,10.36 13.43,8.73 11.56,8.73 11.36,8.93 11.36,8.94 11.06,9.24 10.64,9.24 10.34,8.94 10.34,8.12 9.92,7.7 v2(6.22,7.7)
BOOTSEL: length 2.3
  Top Layer w0.2: NOREF#7.18 17.45,3.1 R17.2
GPS_1PPS: length 38.5
  Top Layer w0.2: U1.28 7.89,13.72 v2(7.87,13.72) ; U5.4 31.55,8.89 v2(33.02,8.89)
  Bottom Layer w0.2: v2(33.02,8.89) 33.02,9.65 34.04,10.67 34.04,13.21 33.27,13.98 33.27,14.31 32.46,15.11 31.83,15.11 31.71,15.24 29.8,15.24 29.68,15.11 21.29,15.11 21.29,15.11 20.37,15.11 20.37,15.11 19.13,15.11 18.62,14.61 18.12,14.61 16.97,15.75 12.36,15.75 11.78,16.33 8.29,16.33 6.98,15.02 6.98,14.9 6.95,14.87 6.95,14.02 7.26,13.72 v2(7.87,13.72)
GPS_3V3: length 19.8
  Top Layer w0.2: C22.2 30.64,4.45 U5.8 ; 19.82,8.9 v2(19.94,9.02)
  Top Layer w0.4: Q2.3 19.82,8.9 ; v2(33.02,4.45) 31.51,4.45 U5.8
  Bottom Layer w0.4: v2(33.02,4.45) 25.54,4.45 25.13,4.86 23.77,4.86 22.62,6 22.62,6.33 v2(19.94,9.02)
GPS_VCC_ON_N: length 17.7
  Top Layer w0.2: R28.1 7.46,14.02 7.66,14.22 8.39,14.22 8.6,14.01 8.6,13.4 U1.27 ; v2(17.4,10.03) 17.52,9.91 Q2.1
  Bottom Layer w0.2: v2(7.46,14.23) 8.34,15.11 9.03,15.11 9.12,15.2 9.58,15.2 9.69,15.09 14.75,15.09 17.4,12.45 v2(17.4,10.03)
I2C0_SCL: length 2.5
  Top Layer w0.2: NOREF#2.17 15.2,8.73 15.2,8.2 15.01,8.01 U1.3
I2C0_SDA: length 1.9
  Top Layer w0.2: U1.2 15.61,7.61 NOREF#11.17
LED: length 0.8
  Top Layer w0.2: R18.2 6.73,9.22
NRESET: length 7.3
  Top Layer w0.2: U1.26 9,13.4 9,14.01 8.95,14.06 8.95,14.16 8.37,14.74 7.23,14.74 6.86,15.11 v2(6.48,15.11) ; v2(4.19,14.99) 3.62,15.56 U10.2
  Bottom Layer w0.2: v2(4.19,14.99) 4.32,15.11 v2(6.48,15.11)
QSPI_SCLK: length 6.5
  Top Layer w0.2: U2.6 13.21,2.31 v2(13.33,2.43) ; U1.52 11.9,6.21 11.9,2.76 12.13,2.53 v2(12.13,2.16)
  Bottom Layer w0.2: v2(13.33,2.43) 13.06,2.16 v2(12.13,2.16)
QSPI_SD0: length 5.3
  Top Layer w0.2: U2.5 12.71,1.92 12.63,2 12.63,2.01 12.82,2.2 12.82,2.62 12.8,2.65 12.51,2.65 12.36,2.79 12.36,3.39 12.29,3.46 12.29,3.88 12.32,3.91 12.32,4.96 12.35,4.99 12.35,5.55 12.3,5.6 12.3,6.21 U1.53
QSPI_SD1: length 2
  Top Layer w0.2: U1.55 13.1,6.21 13.1,5.6 13.71,4.99 U2.2
QSPI_SD2: length 1.9
  Top Layer w0.2: U1.54 12.7,6.21 12.7,5.5 13.21,4.99 U2.3
QSPI_SD3: length 7.1
  Top Layer w0.2: v2(14.1,2.36) 13.71,1.98 U2.7 ; v2(11.34,3.37) 11.45,3.47 U1.51
  Bottom Layer w0.2: v2(14.1,2.36) 13.84,2.62 13.84,2.64 13.31,3.16 12.59,3.16 12.38,3.37 v2(11.34,3.37)
QSPI_SS: length 5
  Top Layer w0.2: 14.99,3.48 15.01,3.48 v2(15.34,3.81) 14.59,4.56 U2.1 14.21,5.5 U1.56
  Bottom Layer w0.2: v2(16.35,3.82) 15.35,3.82 v2(15.34,3.81)
RF_OUT: length 5.3
  Top Layer w0.2: 2.03,11.05 2.16,11.18 7.14,11.18 7.17,11.21 U1.32
SLR1: length 1.6
  Top Layer w0.2: U15.1 20.09,3.13 20.09,2 NOREF#15.18
SLR2: length 1.1
  Top Layer w0.2: 22.61,2.79 22.86,2.54 NOREF#16.18
SLR3: length 0.7
  Top Layer w0.2: U17.1 24.77,3.11 24.77,2.54
UART1_RX: length 23
  Top Layer w0.2: v2(18.92,12.95) 15.75,12.95 15.2,12.41 15.2,11.8 15.06,11.65 14.45,11.65 U1.12 ; v2(33.15,11.05) 31.51,11.05 U5.2
  Bottom Layer w0.2: v2(33.15,11.05) 31.24,12.95 31.2,12.95 30.56,13.59 29.99,13.59 29.35,12.95 20.4,12.95 19.89,12.45 19.48,12.45 18.97,12.95 v2(18.92,12.95)
USB_DM: length 3.6
  Top Layer w0.2: R7.2 8.89,2.75 9.28,2.36 9.96,2.36 NOREF#3.17
USB_DP: length 1.5
  Top Layer w0.2: R6.2 6.81,2.34 7.37,1.78
XIN: length 5.6
  Top Layer w0.2: U1.20 11.5,13.4 11.5,14.42 11.9,14.82 12.91,14.82 13.17,15.08 C5.2 14.09,15.08 X2.1
XOUT: length 2.4
  Top Layer w0.2: R22.1 11.81,15.37 11,14.56 11,13.4 U1.21
$1N22007: length 1.5
  Top Layer w0.2: 8.89,5 9.08,5.19 9.13,5.19 9.45,5.51 U1.46
$1N22362: length 4.4
  Top Layer w0.2: U1.47 9.8,6.21 9.8,5 v2(9.7,4.9) ; R6.1 8.17,3.05 v2(8.28,3.15)
  Bottom Layer w0.2: v2(8.28,3.15) 9.22,4.09 9.29,4.09 9.55,4.35 9.55,4.42 9.7,4.58 v2(9.7,4.9)
$1N70752: length 9.8
  Top Layer w0.2: 10.32,16.13 11.63,16.13 R22.2 12.52,16.31 v2(12.57,16.26) ; v2(18.41,15.11) 17.95,15.11 X2.3
  Bottom Layer w0.2: v2(18.41,15.11) 17.27,16.26 v2(12.57,16.26)
$1N115739: length 2.7
  Top Layer w0.2: C35.2 4.32,13.25 U10.3 5.16,12.91 R10.1
$1N146095: length 1.2
  Top Layer w0.2: U11.2 4.84,10.09 R18.1
$1N150578: length 2
  Top Layer w0.6: U5.11 41.14,4.45 U19.1
$1N152319: length 2.6
  Top Layer w0.3: L1.1 24.28,9.23 24.56,8.95
$1N152323: length 3.3
  Top Layer w0.4: R27.2 R26.1 27.51,6.8 U18.4

## Copper pours and planes (outline as drawn; the poured copper is in the pictures)
3V3 on Top Layer: 8.12,12.6 8.69,12.6 8.69,7.08 8.12,7.08
3V3 on Top Layer: 13.14,12.6 13.52,12.6 13.52,7.04 13.14,7.04
3V3 on Top Layer: 8.69,12.6 13.52,12.6 13.52,12.22 8.69,12.22
3V3 on Top Layer: 10.22,7.33 17.27,7.33 17.27,7.11 10.22,7.11
GND on Top Layer: -8.89,19.94 42.04,19.94 42.04,-4.32 -8.89,-4.32
GND on Bottom Layer: -40,35.05 42.04,35.05 42.04,-11.94 -40,-11.94

Small or netless copper shapes (teardrops, artwork), in the pictures only: 2 on Top Layer

## Text on the board
Bottom Silkscreen Layer: I2C0 SCL | I2C0 SDA | SOLAR 1   2    3 | D- D+ | BOOT | VBUS | 5V | 3v | GND | TX RF | ADC1 DS18 | KC3LBR | GPS | pico-WSPRer rev 7
Top Silkscreen Layer: D+ | USB | D- | VBUS | S1 | S2 | S3 | ADC1 | RF | BOOT | GND | callsign: | pico-WSPRer rev7 | 3V3 | 5V | GPS | email ___________ if found | Thank you!
